# EAGLE design schemat (EAGLE 9.4.2)
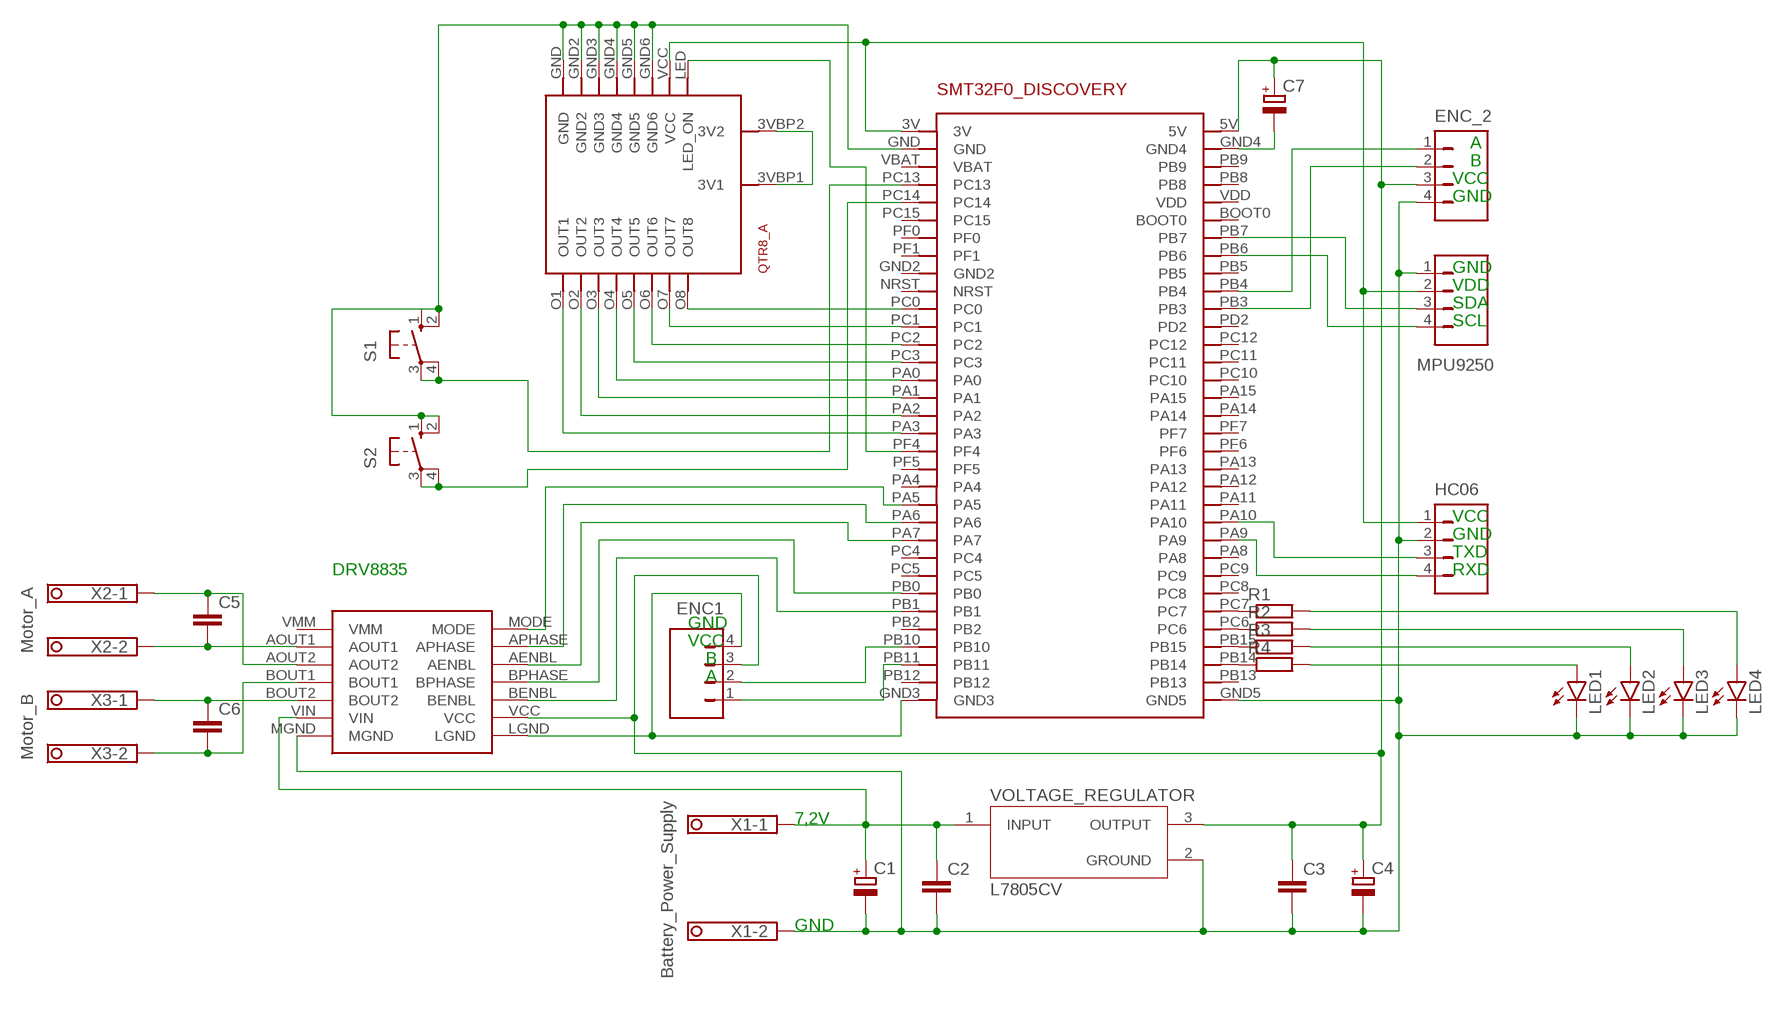
[diagram p0: schematic, sheet 1]

## Parts
C1  CPOL-EUE2.5-6  [E2,5-6]
C2  C-EU025-024X044  [C025-024X044]
C3  C-EU025-024X044  [C025-024X044]
C4  CPOL-EUE2.5-6  [E2,5-6]
C5  C-EU025-024X044  [C025-024X044]
C6  C-EU025-024X044  [C025-024X044]
C7  CPOL-EUE2.5-6  [E2,5-6]
DRV8835  POLOLU_MOTOR_DRV8835THROUGHHOLE  [POLOLU_MOTOR_DRV_DRV8835]
ENC1  JP4E  [JP4]
ENC_2  JP4E  [JP4]
HC06  JP4E  [JP4]
LED1  LEDB152  [Q62902-B152]
LED2  LEDB152  [Q62902-B152]
LED3  LEDB152  [Q62902-B152]
LED4  LEDB152  [Q62902-B152]
MPU9250  JP4E  [JP4]
R1  R-EU_0207/7  [0207/7]
R2  R-EU_0207/7  [0207/7]
R3  R-EU_0207/7  [0207/7]
R4  R-EU_0207/7  [0207/7]
S1  10-XX  [B3F-10XX]
S2  10-XX  [B3F-10XX]
SMT32F0_DISCOVERY  STM32F0_DISCOVERY  [STM32F0_DISCOVERY]
U$1  QTR8_A  [QTR8_A]
VOLTAGE_REGULATOR  L7805CV  [TO255P1040X460X1968-3]
X1  Battery_Power_Supply  1751248  [1751248]
X2  Motor_A  1751248  [1751248]
X3  Motor_B  1751248  [1751248]

## Nets
3V: HC06.1 MPU9250.2 SMT32F0_DISCOVERY.3V U$1.VCC
5V: C3.1 C4.+ C7.+ DRV8835.VCC ENC1.3 ENC_2.3 SMT32F0_DISCOVERY.5V VOLTAGE_REGULATOR.3(OUTPUT)
+7,2V: C1.+ C2.1 DRV8835.VIN VOLTAGE_REGULATOR.1(INPUT) X1.1
GND: C1.- C2.2 C3.2 C4.- DRV8835.MGND ENC_2.4 HC06.2 LED1.K(C) LED2.K(C) LED3.K(C) LED4.K(C) MPU9250.1 SMT32F0_DISCOVERY.GND5 VOLTAGE_REGULATOR.2(GROUND) X1.2
N$1: C7.- SMT32F0_DISCOVERY.GND4
N$2: DRV8835.LGND ENC1.4 SMT32F0_DISCOVERY.GND3
N$3: C5.2 DRV8835.AOUT1 X2.2
N$4: SMT32F0_DISCOVERY.PC0 U$1.O8(OUT8)
N$5: ENC1.2 SMT32F0_DISCOVERY.PB10
N$6: R1.1 SMT32F0_DISCOVERY.PC7
N$7: ENC1.1 SMT32F0_DISCOVERY.PB11
N$8: SMT32F0_DISCOVERY.PA1 U$1.O3(OUT3)
N$9: U$1.3VBP1(3V1) U$1.3VBP2(3V2)
N$10: HC06.3 SMT32F0_DISCOVERY.PA10
N$11: HC06.4 SMT32F0_DISCOVERY.PA9
N$12: MPU9250.3 SMT32F0_DISCOVERY.PB7
N$13: MPU9250.4 SMT32F0_DISCOVERY.PB6
N$14: SMT32F0_DISCOVERY.PA2 U$1.O2(OUT2)
N$15: SMT32F0_DISCOVERY.PA3 U$1.O1(OUT1)
N$16: DRV8835.BENBL SMT32F0_DISCOVERY.PB1
N$17: DRV8835.BPHASE SMT32F0_DISCOVERY.PB0
N$18: SMT32F0_DISCOVERY.PC1 U$1.O7(OUT7)
N$19: SMT32F0_DISCOVERY.PC2 U$1.O6(OUT6)
N$20: S1.3(P) S1.4(P1) SMT32F0_DISCOVERY.PC13
N$21: R2.1 SMT32F0_DISCOVERY.PC6
N$22: C6.2 DRV8835.BOUT1 X3.2
N$23: S1.1(S) S1.2(S1) S2.1(S) S2.2(S1) SMT32F0_DISCOVERY.GND U$1.GND U$1.GND2 U$1.GND3 U$1.GND4 U$1.GND5 U$1.GND6
N$24: SMT32F0_DISCOVERY.PC3 U$1.O5(OUT5)
N$25: SMT32F0_DISCOVERY.PA0 U$1.O4(OUT4)
N$26: DRV8835.AENBL SMT32F0_DISCOVERY.PA7
N$27: DRV8835.APHASE SMT32F0_DISCOVERY.PA6
N$28: DRV8835.MODE SMT32F0_DISCOVERY.PA5
N$29: SMT32F0_DISCOVERY.PF4 U$1.LED(LED_ON)
N$30: R3.1 SMT32F0_DISCOVERY.PB15
N$31: ENC_2.2 SMT32F0_DISCOVERY.PB3
N$32: ENC_2.1 SMT32F0_DISCOVERY.PB4
N$33: R4.1 SMT32F0_DISCOVERY.PB14
N$36: LED1.A R4.2
N$37: LED2.A R3.2
N$38: LED3.A R2.2
N$39: LED4.A R1.2
N$40: S2.3(P) S2.4(P1) SMT32F0_DISCOVERY.PC14
N$44: C5.1 DRV8835.AOUT2 X2.1
N$45: C6.1 DRV8835.BOUT2 X3.1
Unconnected: DRV8835.VMM SMT32F0_DISCOVERY.BOOT0 SMT32F0_DISCOVERY.GND2 SMT32F0_DISCOVERY.NRST SMT32F0_DISCOVERY.PA4 SMT32F0_DISCOVERY.PA8 SMT32F0_DISCOVERY.PA11 SMT32F0_DISCOVERY.PA12 SMT32F0_DISCOVERY.PA13 SMT32F0_DISCOVERY.PA14 SMT32F0_DISCOVERY.PA15 SMT32F0_DISCOVERY.PB2 SMT32F0_DISCOVERY.PB5 SMT32F0_DISCOVERY.PB8 SMT32F0_DISCOVERY.PB9 SMT32F0_DISCOVERY.PB12 SMT32F0_DISCOVERY.PB13 SMT32F0_DISCOVERY.PC4 SMT32F0_DISCOVERY.PC5 SMT32F0_DISCOVERY.PC8 SMT32F0_DISCOVERY.PC9 SMT32F0_DISCOVERY.PC10 SMT32F0_DISCOVERY.PC11 SMT32F0_DISCOVERY.PC12 SMT32F0_DISCOVERY.PC15 SMT32F0_DISCOVERY.PD2 SMT32F0_DISCOVERY.PF0 SMT32F0_DISCOVERY.PF1 SMT32F0_DISCOVERY.PF5 SMT32F0_DISCOVERY.PF6 SMT32F0_DISCOVERY.PF7 SMT32F0_DISCOVERY.VBAT SMT32F0_DISCOVERY.VDD

## Notes on the sheet
- A
- B
- VCC
- GND
- GND
- VDD
- SDA
- SCL
- VCC
- GND
- TXD
- DRV8835 | RXD
- GND
- VCC
- B
- A
- 7,2V
- GND

## Library data of the parts
C1 C4 C7 = rcl2:CPOL-EU: POLARIZED CAPACITOR, European symbol; SPICEPREFIX: C
C2 C3 C5 C6 = rcl3:C-EU: CAPACITOR, European symbol; SPICEPREFIX: C
DRV8835 = DRV8835:POLOLU_MOTOR_DRV8835
ENC1 ENC_2 HC06 MPU9250 = jumper:JP4E: JUMPER
LED1-LED4 = led:LED: LED OSRAM: - CHIPLED LG R971, LG N971, LY N971, LG Q971, LY Q971, LO R971, LY R971 LH N974, LH R974 LS Q976, LO Q976, LY Q976 LO Q996 - Hyper CHIPLED LW Q18S LB Q993, LB Q99A, LB R99A - SideLED LS A670, LO A670, LY A670, LG A670, LP A670 LB A673, LV A673, LT A673, LW A673 LH A674 LY A675 LS A676, LA A676, LO A676, LY A676, LW A676 LS A679, LY A679, LG A679 - Hyper Micro SIDELED® LS Y876, LA Y876, LO Y876, LY Y876 LT Y87S - SmartLED LW L88C, LW L88S LB L89C, LB L89S, LG L890 LS L89K, LO L89K, LY L89K LS L896, LA L896, LO L896, LY L896 - TOPLED LS T670, LO T670, LY T670, LG T670, LP T670 LSG T670, LSP T670, LSY T670, LOP T670, LYG T670 LG T671, LOG T671, LSG T671 LB T673, LV T673, LT T673, LW T673 LH T674 LS T676, LA T676, LO T676, LY T676, LB T676, LH T676, LSB T676, LW T676 LB T67C, LV T67C, LT T67C, LS T67K, LO T67K, LY T67K, LW E67C LS E67B, LA E67B, LO E67B, LY E67B, LB E67C, LV E67C, LT E67C LW T67C LS T679, LY T679, LG T679 LS T770, LO T770, LY T770, LG T770, LP T770 LB T773, LV T773, LT T773, LW T773 LH T774 LS E675, LA E675, LY E675, LS T675 LS T776, LA T776, LO T776, LY T776, LB T776 LHGB T686 LT T68C, LB T68C - Hyper Mini TOPLED® LB M676 - Mini TOPLED Santana® LG M470 LS M47K, LO M47K, LY M47K Source: http://www.osram.convergy.de LUXEON: - LUMILED® LXK2-PW12-R00, LXK2-PW12-S00, LXK2-PW14-U00, LXK2-PW14-V00 LXK2-PM12-R00, LXK2-PM12-S00, LXK2-PM14-U00 LXK2-PE12-Q00, LXK2-PE12-R00, LXK2-PE12-S00, LXK2-PE14-T00, LXK2-PE14-U00 LXK2-PB12-K00, LXK2-PB12-L00, LXK2-PB12-M00, LXK2-PB14-N00, LXK2-PB14-P00, LXK2-PB14-Q00 LXK2-PR12-L00, LXK2-PR12-M00, LXK2-PR14-Q00, LXK2-PR14-R00 LXK2-PD12-Q00, LXK2-PD12-R00, LXK2-PD12-S00 LXK2-PH12-R00, LXK2-PH12-S00 LXK2-PL12-P00, LXK2-PL12-Q00, LXK2-PL12-R00 Source: www.luxeon.com KINGBRIGHT: KA-3528ASYC Source: www.kingbright.com
R1-R4 = rcl:R-EU_: RESISTOR, European symbol; SPICEPREFIX: R
S1 S2 = switch-omron:10-XX: OMRON SWITCH; MPN: B3F-1000; OC_FARNELL: 176432; OC_NEWARK: 36M3542
SMT32F0_DISCOVERY = stm32f0discovery:STM32F0_DISCOVERY
U$1 = QTR8_A:QTR8_A
VOLTAGE_REGULATOR = L7805CV:L7805CV: Standard Regulator Pos 5V 1.5A 3-Pin(3+Tab) TO-220 Standard Regulator Pos 5V 1.5A 3-Pin(3+Tab) TO-220; AVAILABILITY: Unavailable; DESCRIPTION: Standard Regulator Pos 5V 1.5A 3-Pin_3+Tab_ TO-220 Standard Regulator Pos 5V 1.5A 3-Pin_3+Tab_ TO-220; MF: STMicroelectronics; MP: L7805CV; PACKAGE: TO-220 STMicroelectronics; PRICE: None
X1-X3 = con-phoenix-3501:1751248: MKDS 1/ 2-3,5 Printklemme Nennstrom: 10 A Bemessungsspannung: 160 V Raster: 3,5 mm Polzahl: 2 Montageart: Löten Anschlussart: Schraubanschluss Anschlussrichtung vom Leiter zur Platine: 0° Source: http://eshop.phoenixcontact.com .. 1751248.pdf; OC_FARNELL: unknown; OC_NEWARK: unknown

## Net classes
0 default: width 0.787 mm, drill 0.787 mm, clearance 0.787 mm

## Board
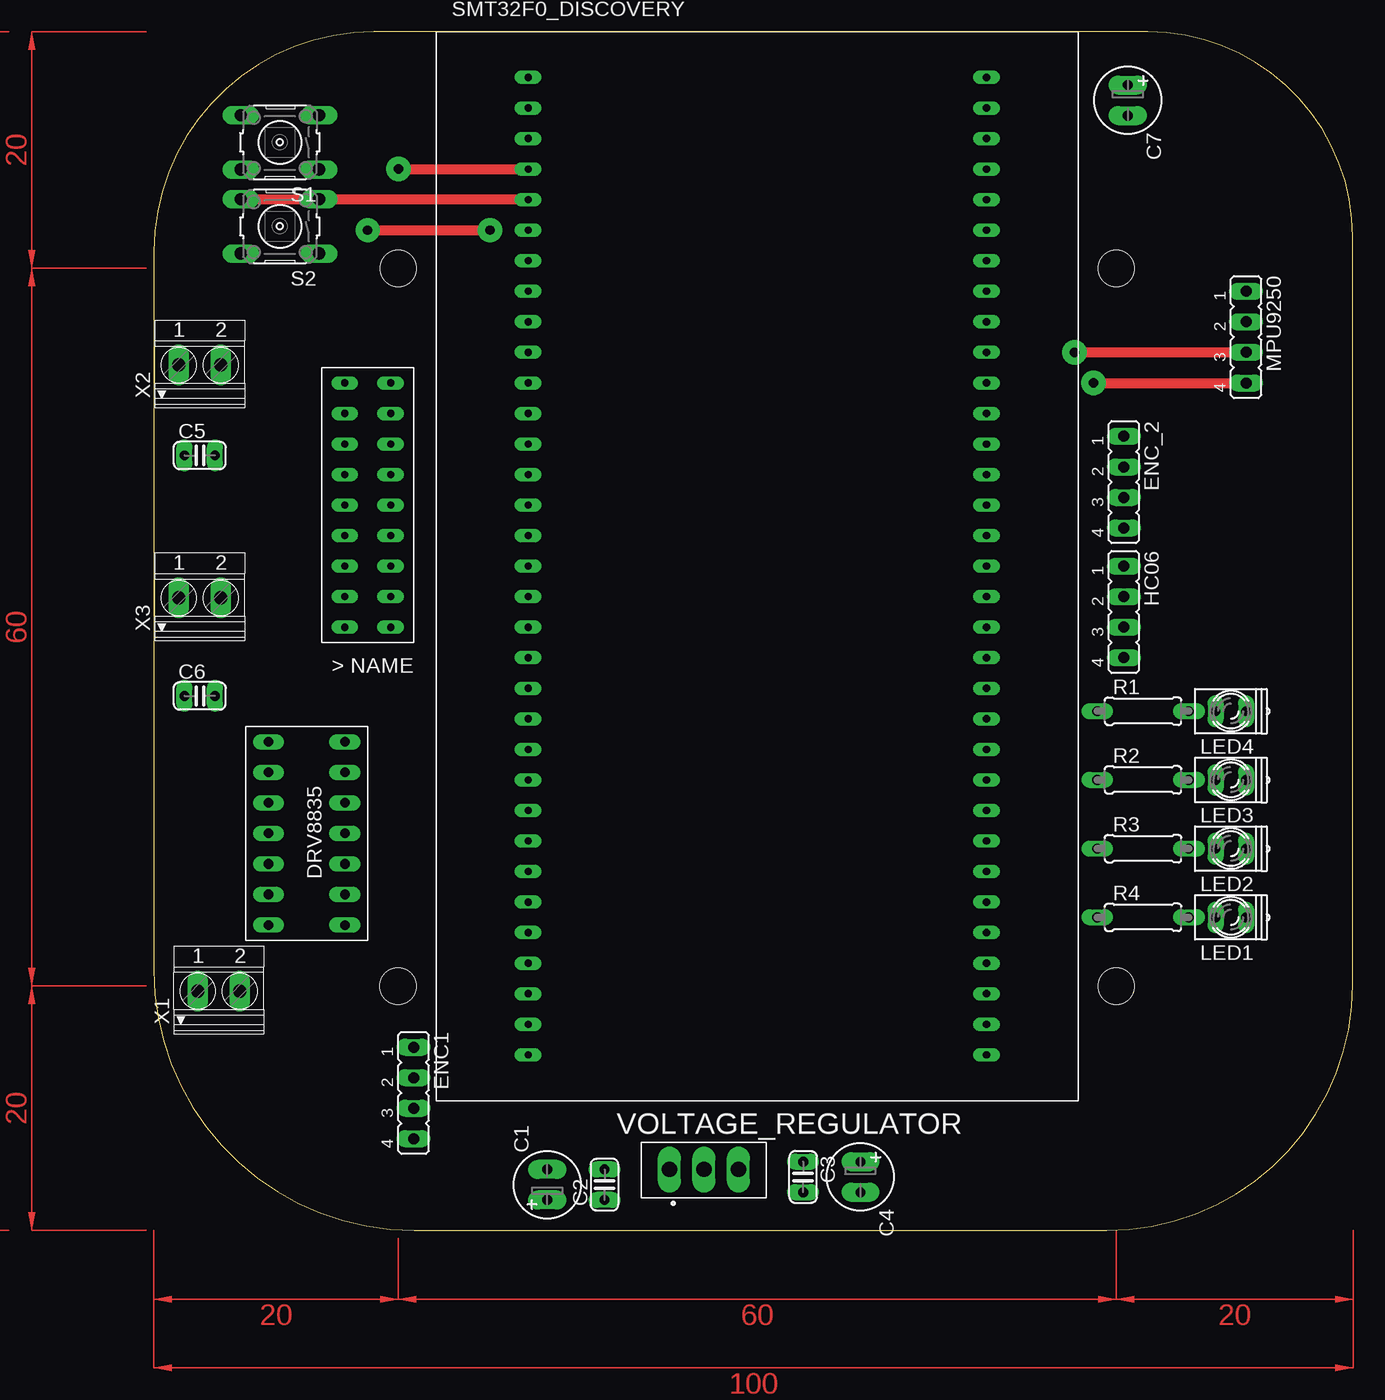
[diagram p1: board, top side]
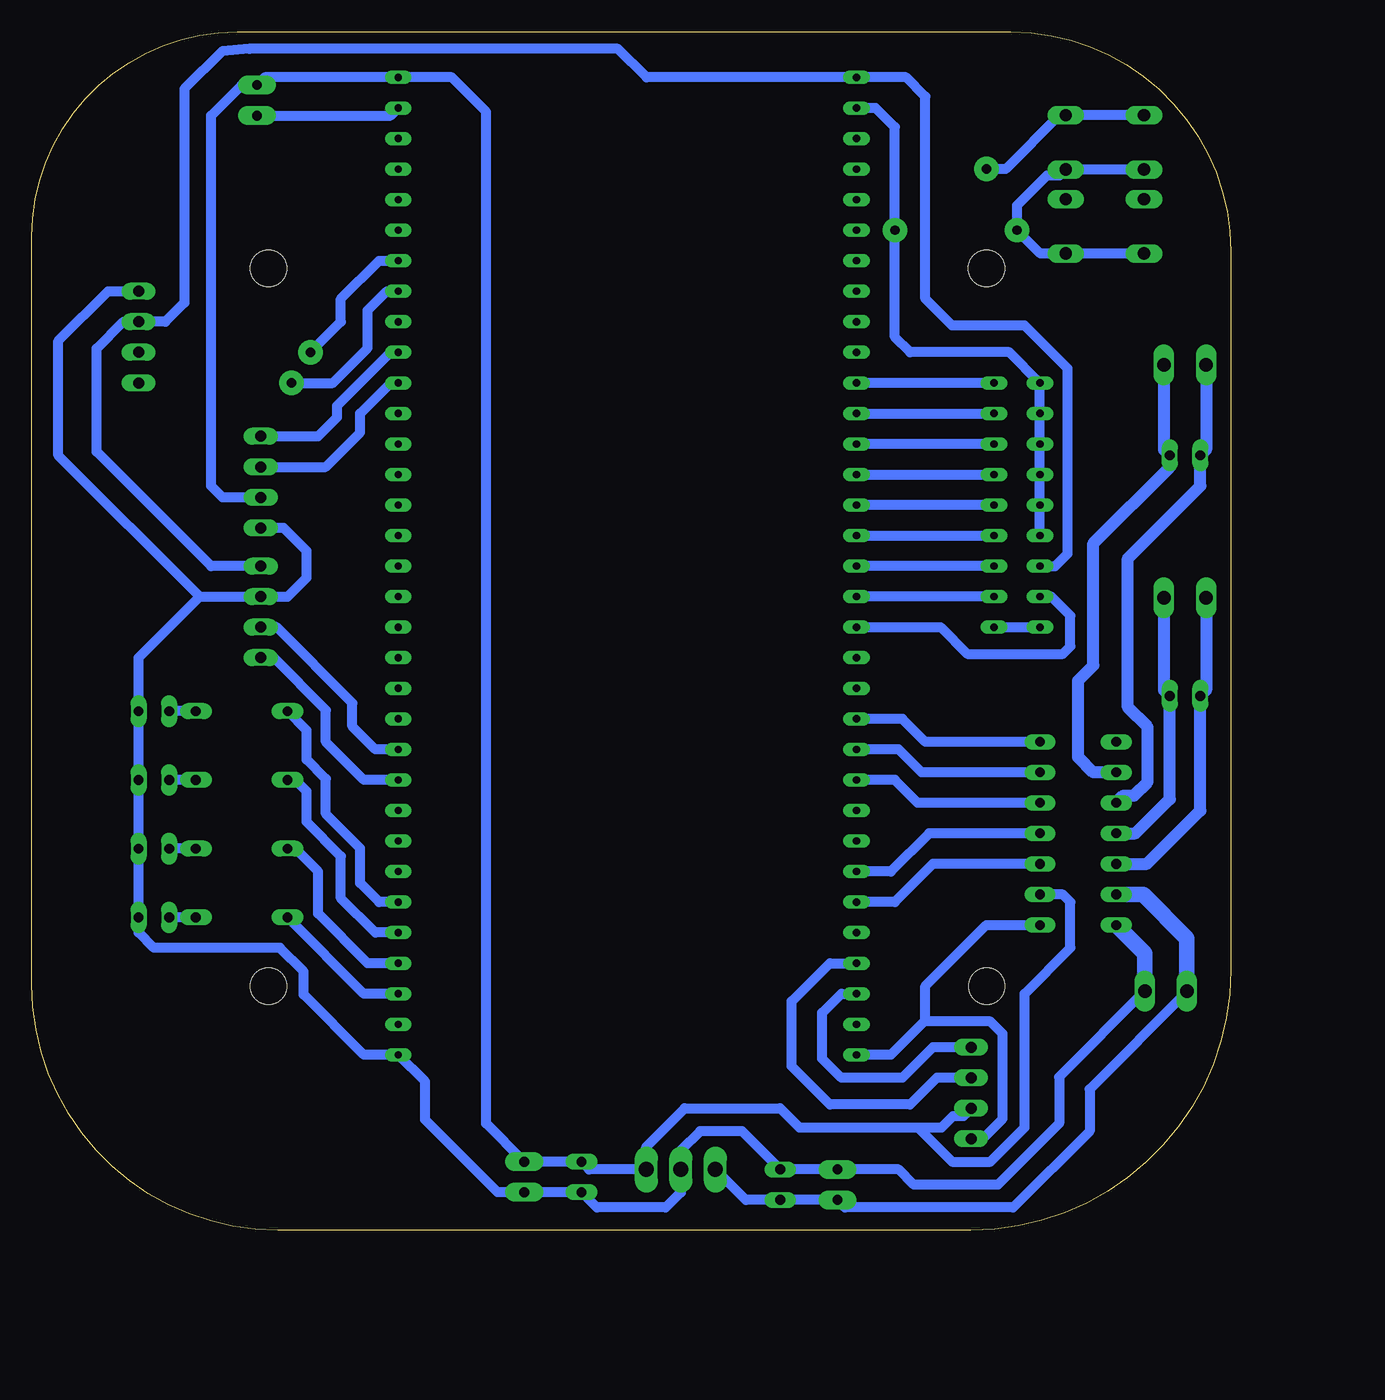
[diagram p2: board, bottom side, seen from below]

Size 99.67 x 99.68 mm. Coordinates in mm from the lower left corner, seen from the top.
Outline: 21.64,0 79.22,0 arc90 99.67,20.46 99.67,82.62 arc90 82.62,99.68 18.29,99.68 arc90 0,81.4 0,21.64 arc90 21.64,0
Copper layers (1*16): Top 0.035mm / dielectric 1.5mm / Bottom 0.035mm
Design rules "default *": minimum track width 0.8mm, minimum drill 0.35mm, track to track 6mil, track to pad 6mil, pad to pad 6mil, via to via 6mil, smd to smd 6mil, copper to edge 40mil, drill to drill 6mil, minimum pad ring 10mil, minimum via ring 8mil, stop-mask expansion 4mil, vias tented up to drill 0mil, thermal gap 10mil
Holes 3 mm at 20.3,20.31 80.01,20.32 20.32,80.01 80.01,80.01

### Footprints (pad centres in the part's own frame; a part is rotated, then mirrored left to right if it is on the bottom)
E2,5-6 = drill 0.813 pad 1.6 long: + -1.27,0; - 1.27,0
C025-024X044 = drill 0.813 long: 1 -1.27,0; 2 1.27,0
POLOLU_MOTOR_DRV_DRV8835 = drill 0.8 long: AENBL 1.905,6.35; AOUT1 8.255,3.81; AOUT2 8.255,6.35; APHASE 1.905,3.81; BENBL 1.905,11.43; BOUT1 8.255,8.89; BOUT2 8.255,11.43; BPHASE 1.905,8.89; LGND 1.905,16.51; MGND 8.255,16.51; MODE 1.905,1.27; VCC 1.905,13.97; VIN 8.255,13.97; VMM 8.255,1.27
JP4 = drill 0.914 long: 1 -3.81,0; 2 -1.27,0; 3 1.27,0; 4 3.81,0
Q62902-B152 = drill 0.813 long: A 1.27,0; K -1.27,0
0207/7 = drill 0.813 long: 1 -3.81,0; 2 3.81,0
B3F-10XX = drill 1.016 long: 1 -3.251,2.261; 2 3.251,2.261; 3 -3.251,-2.261; 4 3.251,-2.261
STM32F0_DISCOVERY = drill 0.6 long: 3V 2.54,83.82; 5V 40.64,83.82; BOOT0 40.64,71.12; GND 2.54,81.28; GND2 2.54,63.5; GND3 2.54,2.54; GND4 40.64,81.28; GND5 40.64,2.54; NRST 2.54,60.96; PA0 2.54,48.26; PA1 2.54,45.72; PA2 2.54,43.18; PA3 2.54,40.64; PA4 2.54,33.02; PA5 2.54,30.48; PA6 2.54,27.94; PA7 2.54,25.4; PA8 40.64,22.86; PA9 40.64,25.4; PA10 40.64,27.94; PA11 40.64,30.48; PA12 40.64,33.02; PA13 40.64,35.56; PA14 40.64,43.18; PA15 40.64,45.72; PB0 2.54,17.78; PB1 2.54,15.24; PB2 2.54,12.7; PB3 40.64,58.42; PB4 40.64,60.96; PB5 40.64,63.5; PB6 40.64,66.04; PB7 40.64,68.58; PB8 40.64,76.2; PB9 40.64,78.74; PB10 2.54,10.16; PB11 2.54,7.62; PB12 2.54,5.08; PB13 40.64,5.08; PB14 40.64,7.62; PB15 40.64,10.16; PC0 2.54,58.42; PC1 2.54,55.88; PC2 2.54,53.34; PC3 2.54,50.8; PC4 2.54,22.86; PC5 2.54,20.32; PC6 40.64,12.7; PC7 40.64,15.24; PC8 40.64,17.78; PC9 40.64,20.32; PC10 40.64,48.26; PC11 40.64,50.8; PC12 40.64,53.34; PC13 2.54,76.2; PC14 2.54,73.66; PC15 2.54,71.12; PD2 40.64,55.88; PF0 2.54,68.58; PF1 2.54,66.04; PF4 2.54,38.1; PF5 2.54,35.56; PF6 40.64,38.1; PF7 40.64,40.64; VBAT 2.54,78.74; VDD 40.64,73.66
QTR8_A = drill 0.6 long: 3VBP1 0.635,25.4; 3VBP2 4.445,25.4; GND 4.445,5.08; GND2 4.445,7.62; GND3 4.445,10.16; GND4 4.445,12.7; GND5 4.445,15.24; GND6 4.445,17.78; LED 4.445,22.86; O1 0.635,22.86; O2 0.635,20.32; O3 0.635,17.78; O4 0.635,15.24; O5 0.635,12.7; O6 0.635,10.16; O7 0.635,7.62; O8 0.635,5.08; VCC 4.445,20.32
TO255P1040X460X1968-3 = drill 1.27 pad 1.91 long: 1 -0.318,0.635; 2 2.55,0.635; 3 5.418,0.635
1751248 = drill 1.1 pad 1.7 long: 1 -1.75,-0.1; 2 1.75,-0.1

### Placement (x,y rotation side)
C1  32.7,3.81 90 top
C2  37.47,3.81 90 top
C3  53.98,4.45 270 top
C4  58.74,4.45 270 top
C5  3.81,64.45 0 top
C6  3.81,44.45 0 top
C7  80.96,93.98 270 top
DRV8835  17.78,41.91 180 top
ENC1  21.59,11.43 270 top
ENC_2  80.64,62.23 270 top
HC06  80.64,51.44 270 top
LED1  89.53,26.04 180 top
LED2  89.53,31.75 180 top
LED3  89.53,37.47 180 top
LED4  89.53,43.18 180 top
MPU9250  90.8,74.3 270 top
R1  82.23,43.18 0 top
R2  82.23,37.47 0 top
R3  82.23,31.75 0 top
R4  82.23,26.04 0 top
S1  10.48,90.49 180 top
S2  10.48,83.5 180 top
SMT32F0_DISCOVERY  28.58,12.06 0 top
U$1  20.32,75.56 180 top
VOLTAGE_REGULATOR  43.18,4.45 0 top
X1  5.4,20 0 top
X2  3.81,72.07 0 top
X3  3.81,52.7 0 top

### Tracks (layer width: path | path; a pad name or v marks a point on that pad's centre or on a via)
3V
  Bottom 0.813: U$1.VCC 14.61,55.24 13.57,56.28 13.57,71.68 17.15,75.25 23.18,75.25 25.4,77.47 25.4,94.3 26.99,95.89 SMT32F0_DISCOVERY.3V 48.58,95.89 50.95,98.26 81.6,98.26 83.87,98.06 86.99,94.93 86.99,77.15 88.58,75.56 90.49,75.56 MPU9250.2 92.07,75.56 94.3,73.34 94.3,64.77 84.77,55.24 HC06.1
5V
  Bottom 0.813: ENC1.3 22.23,9.53 23.09,9.53 24.04,8.57 26.04,8.57 | 26.04,8.57 35.88,8.57 37.47,10.16 45.4,10.16 48.6,6.96 VOLTAGE_REGULATOR.3 53.34,5.08 C3.1 C4.+ 61.91,8.89 61.91,93.03 64.77,95.89 SMT32F0_DISCOVERY.5V 80.33,95.89 C7.+ 82.23,95.25 84.77,92.71 84.77,61.91 83.82,60.96 ENC_2.3 | 26.04,8.57 23.18,5.71 20,5.71 17.15,8.57 17.15,19.68 13.34,23.5 13.34,27.3 13.97,27.94 DRV8835.VCC
+7,2V
  Bottom 0.813: X1.1 3.65,19.85 11.75,11.75 11.75,8.26 18.1,1.91 32.07,1.91 C1.+ C2.1 40.32,2.54 VOLTAGE_REGULATOR.1
  Bottom 1.3: X1.1 3.65,24.29 7.3,27.94 DRV8835.VIN
GND
  Bottom 0.813: X1.2 14.29,12.76 14.29,8.89 19.37,3.81 26.35,3.81 27.62,5.08 C1.- C2.2 40.64,8.26 44.13,8.26 45.73,6.66 VOLTAGE_REGULATOR.2 45.73,3.17 46.99,1.91 52.71,1.91 C3.2 C4.- 60.96,3.17 66.99,9.21 66.99,12.38 SMT32F0_DISCOVERY.GND5 72.07,14.61 77.09,19.62 77.09,21.53 79.05,23.5 89.53,23.5 90.8,24.77 LED1.K LED2.K LED3.K LED4.K 90.8,47.62 85.72,52.7 | 85.72,52.7 HC06.2 78.42,52.7 76.83,54.29 76.83,56.52 78.74,58.42 ENC_2.4 | MPU9250.1 93.34,78.11 97.47,73.98 97.47,64.45 85.72,52.7
  Bottom 1.3: X1.2 7.15,23.02 DRV8835.MGND
N$1
  Bottom 0.813: C7.- 69.85,92.71 SMT32F0_DISCOVERY.GND4
N$2
  Bottom 0.813: ENC1.4 20.64,7.62 18.97,9.28 18.97,16.36 20,17.38 25.48,17.38 | 25.48,17.38 28.26,14.61 SMT32F0_DISCOVERY.GND3 | 25.48,17.38 25.4,17.46 25.4,20.32 20.32,25.4 DRV8835.LGND
N$3
  Bottom 1: DRV8835.AOUT1 11.43,38.1 12.7,39.37 12.7,45.72 11.43,46.99 11.43,57.15 5.08,63.5 C5.2 5.56,64.93 X2.2
N$4
  Bottom 0.813: U$1.O8 SMT32F0_DISCOVERY.PC0
N$5
  Bottom 0.813: ENC1.2 24.45,12.7 26.67,10.48 33.34,10.48 36.51,13.65 36.51,19.05 33.34,22.23 SMT32F0_DISCOVERY.PB10
N$6
  Bottom 0.813: SMT32F0_DISCOVERY.PC7 70.8,27.3 72.38,28.88 72.38,31.78 75.23,34.63 75.23,37.56 76.83,39.16 76.83,41.59 R1.1
N$7
  Bottom 0.813: ENC1.1 24.77,15.24 27.3,12.7 32.38,12.7 33.97,14.29 33.97,18.1 32.38,19.68 SMT32F0_DISCOVERY.PB11
N$8
  Bottom 0.813: SMT32F0_DISCOVERY.PA1 U$1.O3
N$9
  Bottom 0.813: U$1.3VBP1 U$1.3VBP2
N$10
  Bottom 0.813: SMT32F0_DISCOVERY.PA10 71.12,40.01 73.02,41.91 73.02,43.86 79.33,50.16 HC06.3
N$11
  Bottom 0.813: HC06.4 79.58,47.62 75.23,43.27 75.23,40.63 72.07,37.47 SMT32F0_DISCOVERY.PA9
N$12  (via drill 0.79 pad 2.03)
  Top 0.813: v76.52,73.03 MPU9250.3
  Bottom 0.813: v76.52,73.03 73.98,75.56 73.98,77.47 70.8,80.64 SMT32F0_DISCOVERY.PB7
N$13  (via drill 0.79 pad 2.03)
  Top 0.8: 69.85,78.11 SMT32F0_DISCOVERY.PB6
  Top 0.813: v78.1,70.48 MPU9250.4
  Bottom 0.813: v78.1,70.48 74.65,70.48 71.75,73.38 71.75,76.52 70.17,78.11 SMT32F0_DISCOVERY.PB6
N$14
  Bottom 0.813: U$1.O2 SMT32F0_DISCOVERY.PA2
N$15
  Bottom 0.813: U$1.O1 SMT32F0_DISCOVERY.PA3
N$16
  Bottom 0.813: DRV8835.BENBL 24.77,30.48 27.94,27.3 SMT32F0_DISCOVERY.PB1
N$17
  Bottom 0.813: DRV8835.BPHASE 25.08,33.02 28.26,29.84 SMT32F0_DISCOVERY.PB0
N$18
  Bottom 0.813: SMT32F0_DISCOVERY.PC1 U$1.O7
N$19
  Bottom 0.813: U$1.O6 SMT32F0_DISCOVERY.PC2
N$20  (via drill 0.79 pad 2.03)
  Top 0.813: v20.32,88.27 SMT32F0_DISCOVERY.PC13
  Bottom 0.813: S1.4 S1.3 14.25,92.75 18.73,88.27 v20.32,88.27
N$21
  Bottom 0.813: SMT32F0_DISCOVERY.PC6 71.12,24.77 73.98,27.62 73.98,31.11 76.83,33.97 76.83,36.51 77.79,37.47 R2.1
N$22
  Bottom 1: DRV8835.BOUT1 7.94,33.02 5.08,35.88 C6.2 5.56,44.93 X3.2
N$23  (via drill 0.79 pad 2.03)
  Top 0.813: v17.78,83.19 v27.94,83.19
  Bottom 0.813: S1.2 S1.1 14.24,87.72 15.3,87.72 17.78,85.24 v17.78,83.19 15.84,81.24 S2.1 S2.2 | U$1.GND6 U$1.GND5 U$1.GND4 U$1.GND3 U$1.GND2 U$1.GND 18.41,73.03 26.67,73.03 27.94,74.3 v27.94,83.19 27.94,91.76 29.53,93.34 SMT32F0_DISCOVERY.GND
N$24
  Bottom 0.813: SMT32F0_DISCOVERY.PC3 U$1.O5
N$25
  Bottom 0.813: U$1.O4 SMT32F0_DISCOVERY.PA0
N$26
  Bottom 0.813: DRV8835.AENBL 26.04,35.56 27.94,37.47 SMT32F0_DISCOVERY.PA7
N$27
  Bottom 0.813: DRV8835.APHASE 25.72,38.1 27.62,40.01 SMT32F0_DISCOVERY.PA6
N$28
  Bottom 0.813: DRV8835.MODE 25.4,40.64 27.3,42.55 SMT32F0_DISCOVERY.PA5
N$29
  Bottom 0.813: SMT32F0_DISCOVERY.PF4 24.13,50.16 21.91,47.94 13.97,47.94 13.34,48.58 13.34,51.12 14.92,52.7 U$1.LED
N$30
  Bottom 0.813: SMT32F0_DISCOVERY.PB15 71.75,22.23 75.88,26.35 75.88,29.84 77.79,31.75 R3.1
N$31
  Bottom 0.813: ENC_2.2 75.25,63.5 72.39,66.36 72.39,67.94 69.85,70.48 SMT32F0_DISCOVERY.PB3
N$32
  Bottom 0.813: ENC_2.1 75.88,66.04 74.3,67.63 74.3,68.58 69.85,73.03 SMT32F0_DISCOVERY.PB4
N$33
  Bottom 0.813: R4.1 72.07,19.68 SMT32F0_DISCOVERY.PB14
N$36
  Bottom 0.813: R4.2 LED1.A
N$37
  Bottom 0.813: R3.2 LED2.A
N$38
  Bottom 0.813: R2.2 LED3.A
N$39
  Bottom 0.813: R1.2 LED4.A
N$40
  Top 0.813: S2.4 S2.3 31.08,85.76 SMT32F0_DISCOVERY.PC14
N$44
  Bottom 1: X2.1 2.06,64.93 C5.1 2.54,61.91 8.57,55.88 8.57,43.5 6.93,41.85 6.93,37.3 8.07,36.16 8.93,36.16 DRV8835.AOUT2
N$45
  Bottom 1: DRV8835.BOUT2 6.99,30.48 2.54,34.92 C6.1 2.06,44.93 X3.1
(copper drawn outside any net)
  shapes: Top area x8